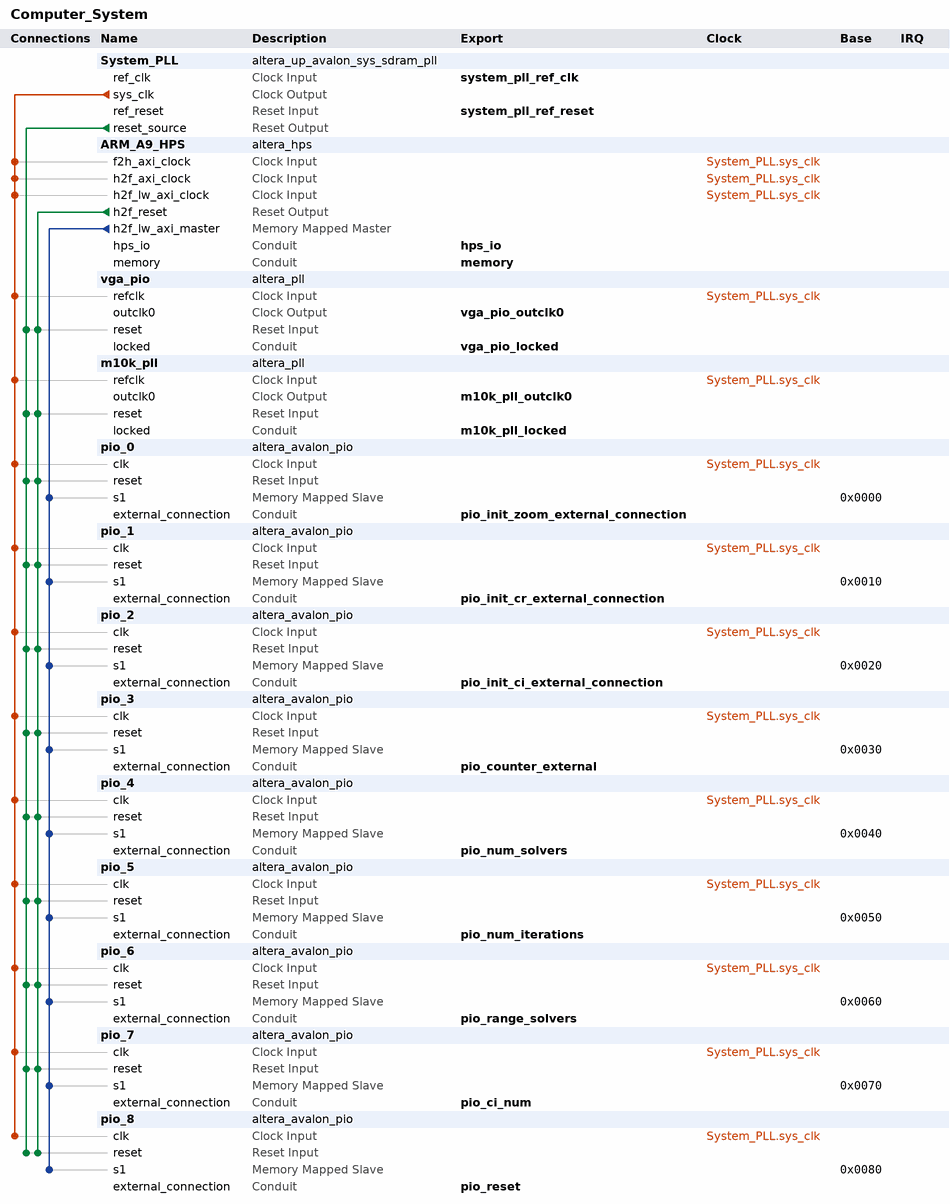
[diagram p0: system contents]
# Platform Designer (Qsys) system Computer_System, Cyclone V 5CSEMA5F31C6
# Parameters at their usual value, and those the tool derives, are not listed.
package require -exact qsys 18.1
create_system Computer_System
set_project_property DEVICE_FAMILY {Cyclone V}
set_project_property DEVICE 5CSEMA5F31C6

add_instance System_PLL altera_up_avalon_sys_sdram_pll 18.0
set_instance_parameter_value System_PLL CV_boards DE1-SoC
set_instance_parameter_value System_PLL gui_outclk 100.0
set_instance_parameter_value System_PLL gui_refclk 50.0

add_instance ARM_A9_HPS altera_hps 18.1
set_instance_parameter_value ARM_A9_HPS EMAC1_Mode RGMII
set_instance_parameter_value ARM_A9_HPS EMAC1_PinMuxing {HPS I/O Set 0}
set_instance_parameter_value ARM_A9_HPS F2SCLK_COLDRST_Enable false
set_instance_parameter_value ARM_A9_HPS F2SCLK_DBGRST_Enable false
set_instance_parameter_value ARM_A9_HPS F2SCLK_WARMRST_Enable false
set_instance_parameter_value ARM_A9_HPS F2SINTERRUPT_Enable true
set_instance_parameter_value ARM_A9_HPS F2S_Width 2
set_instance_parameter_value ARM_A9_HPS FPGA_PERIPHERAL_OUTPUT_CLOCK_FREQ_EMAC0_GTX_CLK 125
set_instance_parameter_value ARM_A9_HPS FPGA_PERIPHERAL_OUTPUT_CLOCK_FREQ_EMAC0_MD_CLK 100.0
set_instance_parameter_value ARM_A9_HPS FPGA_PERIPHERAL_OUTPUT_CLOCK_FREQ_EMAC1_GTX_CLK 125
set_instance_parameter_value ARM_A9_HPS FPGA_PERIPHERAL_OUTPUT_CLOCK_FREQ_EMAC1_MD_CLK 100.0
set_instance_parameter_value ARM_A9_HPS HPS_PROTOCOL DDR3
set_instance_parameter_value ARM_A9_HPS I2C0_Mode I2C
set_instance_parameter_value ARM_A9_HPS I2C0_PinMuxing {HPS I/O Set 0}
set_instance_parameter_value ARM_A9_HPS I2C1_Mode I2C
set_instance_parameter_value ARM_A9_HPS I2C1_PinMuxing {HPS I/O Set 0}
set_instance_parameter_value ARM_A9_HPS LWH2F_Enable true
set_instance_parameter_value ARM_A9_HPS MEM_BANKADDR_WIDTH 3
set_instance_parameter_value ARM_A9_HPS MEM_CLK_FREQ 400.0
set_instance_parameter_value ARM_A9_HPS MEM_COL_ADDR_WIDTH 10
set_instance_parameter_value ARM_A9_HPS MEM_DQ_WIDTH 32
set_instance_parameter_value ARM_A9_HPS MEM_DRV_STR RZQ/7
set_instance_parameter_value ARM_A9_HPS MEM_ROW_ADDR_WIDTH 15
set_instance_parameter_value ARM_A9_HPS MEM_RTT_NOM RZQ/4
set_instance_parameter_value ARM_A9_HPS MEM_RTT_WR RZQ/4
set_instance_parameter_value ARM_A9_HPS MEM_TCL 11
set_instance_parameter_value ARM_A9_HPS MEM_TFAW_NS 30.0
set_instance_parameter_value ARM_A9_HPS MEM_TRAS_NS 35.0
set_instance_parameter_value ARM_A9_HPS MEM_TRCD_NS 13.75
set_instance_parameter_value ARM_A9_HPS MEM_TRFC_NS 260.0
set_instance_parameter_value ARM_A9_HPS MEM_TRP_NS 13.75
set_instance_parameter_value ARM_A9_HPS MEM_VENDOR JEDEC
set_instance_parameter_value ARM_A9_HPS MEM_WTCL 8
set_instance_parameter_value ARM_A9_HPS QSPI_Mode {1 SS}
set_instance_parameter_value ARM_A9_HPS QSPI_PinMuxing {HPS I/O Set 0}
set_instance_parameter_value ARM_A9_HPS REF_CLK_FREQ 25.0
set_instance_parameter_value ARM_A9_HPS S2FCLK_USER2CLK 5
set_instance_parameter_value ARM_A9_HPS S2F_Width 3
set_instance_parameter_value ARM_A9_HPS SDIO_Mode {4-bit Data}
set_instance_parameter_value ARM_A9_HPS SDIO_PinMuxing {HPS I/O Set 0}
set_instance_parameter_value ARM_A9_HPS SPIM1_Mode {Single Slave Select}
set_instance_parameter_value ARM_A9_HPS SPIM1_PinMuxing {HPS I/O Set 0}
set_instance_parameter_value ARM_A9_HPS STM_Enable false
set_instance_parameter_value ARM_A9_HPS TIMING_BOARD_AC_SKEW 0.03
set_instance_parameter_value ARM_A9_HPS TIMING_BOARD_AC_TO_CK_SKEW 0.0
set_instance_parameter_value ARM_A9_HPS TIMING_BOARD_DQ_TO_DQS_SKEW 0.0
set_instance_parameter_value ARM_A9_HPS TIMING_BOARD_MAX_CK_DELAY 0.03
set_instance_parameter_value ARM_A9_HPS TIMING_BOARD_MAX_DQS_DELAY 0.02
set_instance_parameter_value ARM_A9_HPS TIMING_BOARD_SKEW_BETWEEN_DQS 0.08
set_instance_parameter_value ARM_A9_HPS TIMING_BOARD_SKEW_CKDQS_DIMM_MAX 0.16
set_instance_parameter_value ARM_A9_HPS TIMING_BOARD_SKEW_CKDQS_DIMM_MIN 0.09
set_instance_parameter_value ARM_A9_HPS TIMING_BOARD_SKEW_WITHIN_DQS 0.01
set_instance_parameter_value ARM_A9_HPS TIMING_TDH 65
set_instance_parameter_value ARM_A9_HPS TIMING_TDQSCK 255
set_instance_parameter_value ARM_A9_HPS TIMING_TDQSQ 125
set_instance_parameter_value ARM_A9_HPS TIMING_TDS 30
set_instance_parameter_value ARM_A9_HPS TIMING_TIH 140
set_instance_parameter_value ARM_A9_HPS TIMING_TIS 180
set_instance_parameter_value ARM_A9_HPS TIMING_TQSH 0.4
set_instance_parameter_value ARM_A9_HPS UART0_Mode {No Flow Control}
set_instance_parameter_value ARM_A9_HPS UART0_PinMuxing {HPS I/O Set 0}
set_instance_parameter_value ARM_A9_HPS USB1_Mode SDR
set_instance_parameter_value ARM_A9_HPS USB1_PinMuxing {HPS I/O Set 0}
set_instance_parameter_value ARM_A9_HPS desired_cfg_clk_mhz 100.0
set_instance_parameter_value ARM_A9_HPS desired_qspi_clk_mhz 400.0

add_instance vga_pio altera_pll 18.1
set_instance_parameter_value vga_pio gui_device_speed_grade 2
set_instance_parameter_value vga_pio gui_number_of_clocks 1
set_instance_parameter_value vga_pio gui_operation_mode direct
set_instance_parameter_value vga_pio gui_output_clock_frequency0 25.0
set_instance_parameter_value vga_pio gui_pll_mode {Integer-N PLL}
set_instance_parameter_value vga_pio gui_reference_clock_frequency 100.0
set_instance_parameter_value vga_pio gui_use_locked true

add_instance m10k_pll altera_pll 18.1
set_instance_parameter_value m10k_pll gui_device_speed_grade 2
set_instance_parameter_value m10k_pll gui_number_of_clocks 1
set_instance_parameter_value m10k_pll gui_operation_mode direct
set_instance_parameter_value m10k_pll gui_output_clock_frequency0 100.0
set_instance_parameter_value m10k_pll gui_pll_mode {Integer-N PLL}
set_instance_parameter_value m10k_pll gui_reference_clock_frequency 100.0
set_instance_parameter_value m10k_pll gui_use_locked true

add_instance pio_0 altera_avalon_pio 18.1
set_instance_parameter_value pio_0 direction Output
set_instance_parameter_value pio_0 width 32

add_instance pio_1 altera_avalon_pio 18.1
set_instance_parameter_value pio_1 direction Output
set_instance_parameter_value pio_1 width 32

add_instance pio_2 altera_avalon_pio 18.1
set_instance_parameter_value pio_2 direction Output
set_instance_parameter_value pio_2 width 32

add_instance pio_3 altera_avalon_pio 18.1
set_instance_parameter_value pio_3 direction Input
set_instance_parameter_value pio_3 width 32

add_instance pio_4 altera_avalon_pio 18.1
set_instance_parameter_value pio_4 direction Output
set_instance_parameter_value pio_4 width 32

add_instance pio_5 altera_avalon_pio 18.1
set_instance_parameter_value pio_5 direction Output
set_instance_parameter_value pio_5 width 32

add_instance pio_6 altera_avalon_pio 18.1
set_instance_parameter_value pio_6 direction Output
set_instance_parameter_value pio_6 width 32

add_instance pio_7 altera_avalon_pio 18.1
set_instance_parameter_value pio_7 direction Output
set_instance_parameter_value pio_7 width 32

add_instance pio_8 altera_avalon_pio 18.1
set_instance_parameter_value pio_8 direction Output
set_instance_parameter_value pio_8 width 32

# connections
add_connection System_PLL.sys_clk ARM_A9_HPS.f2h_axi_clock clock
add_connection System_PLL.sys_clk ARM_A9_HPS.h2f_axi_clock clock
add_connection System_PLL.sys_clk ARM_A9_HPS.h2f_lw_axi_clock clock
add_connection System_PLL.sys_clk m10k_pll.refclk clock
add_connection System_PLL.sys_clk pio_0.clk clock
add_connection System_PLL.sys_clk pio_1.clk clock
add_connection System_PLL.sys_clk pio_2.clk clock
add_connection System_PLL.sys_clk pio_3.clk clock
add_connection System_PLL.sys_clk pio_4.clk clock
add_connection System_PLL.sys_clk pio_5.clk clock
add_connection System_PLL.sys_clk pio_6.clk clock
add_connection System_PLL.sys_clk pio_7.clk clock
add_connection System_PLL.sys_clk pio_8.clk clock
add_connection System_PLL.sys_clk vga_pio.refclk clock
add_connection ARM_A9_HPS.h2f_reset m10k_pll.reset reset
add_connection ARM_A9_HPS.h2f_reset pio_0.reset reset
add_connection ARM_A9_HPS.h2f_reset pio_1.reset reset
add_connection ARM_A9_HPS.h2f_reset pio_2.reset reset
add_connection ARM_A9_HPS.h2f_reset pio_3.reset reset
add_connection ARM_A9_HPS.h2f_reset pio_4.reset reset
add_connection ARM_A9_HPS.h2f_reset pio_5.reset reset
add_connection ARM_A9_HPS.h2f_reset pio_6.reset reset
add_connection ARM_A9_HPS.h2f_reset pio_7.reset reset
add_connection ARM_A9_HPS.h2f_reset pio_8.reset reset
add_connection ARM_A9_HPS.h2f_reset vga_pio.reset reset
add_connection System_PLL.reset_source m10k_pll.reset reset
add_connection System_PLL.reset_source pio_0.reset reset
add_connection System_PLL.reset_source pio_1.reset reset
add_connection System_PLL.reset_source pio_2.reset reset
add_connection System_PLL.reset_source pio_3.reset reset
add_connection System_PLL.reset_source pio_4.reset reset
add_connection System_PLL.reset_source pio_5.reset reset
add_connection System_PLL.reset_source pio_6.reset reset
add_connection System_PLL.reset_source pio_7.reset reset
add_connection System_PLL.reset_source pio_8.reset reset
add_connection System_PLL.reset_source vga_pio.reset reset
add_connection ARM_A9_HPS.h2f_lw_axi_master pio_0.s1 avalon
set_connection_parameter_value ARM_A9_HPS.h2f_lw_axi_master/pio_0.s1 baseAddress 0x0000
add_connection ARM_A9_HPS.h2f_lw_axi_master pio_1.s1 avalon
set_connection_parameter_value ARM_A9_HPS.h2f_lw_axi_master/pio_1.s1 baseAddress 0x0010
add_connection ARM_A9_HPS.h2f_lw_axi_master pio_2.s1 avalon
set_connection_parameter_value ARM_A9_HPS.h2f_lw_axi_master/pio_2.s1 baseAddress 0x0020
add_connection ARM_A9_HPS.h2f_lw_axi_master pio_3.s1 avalon
set_connection_parameter_value ARM_A9_HPS.h2f_lw_axi_master/pio_3.s1 baseAddress 0x0030
add_connection ARM_A9_HPS.h2f_lw_axi_master pio_4.s1 avalon
set_connection_parameter_value ARM_A9_HPS.h2f_lw_axi_master/pio_4.s1 baseAddress 0x0040
add_connection ARM_A9_HPS.h2f_lw_axi_master pio_5.s1 avalon
set_connection_parameter_value ARM_A9_HPS.h2f_lw_axi_master/pio_5.s1 baseAddress 0x0050
add_connection ARM_A9_HPS.h2f_lw_axi_master pio_6.s1 avalon
set_connection_parameter_value ARM_A9_HPS.h2f_lw_axi_master/pio_6.s1 baseAddress 0x0060
add_connection ARM_A9_HPS.h2f_lw_axi_master pio_7.s1 avalon
set_connection_parameter_value ARM_A9_HPS.h2f_lw_axi_master/pio_7.s1 baseAddress 0x0070
add_connection ARM_A9_HPS.h2f_lw_axi_master pio_8.s1 avalon
set_connection_parameter_value ARM_A9_HPS.h2f_lw_axi_master/pio_8.s1 baseAddress 0x0080

# exported interfaces
add_interface hps_io conduit end
set_interface_property hps_io EXPORT_OF ARM_A9_HPS.hps_io
add_interface m10k_pll_locked conduit end
set_interface_property m10k_pll_locked EXPORT_OF m10k_pll.locked
add_interface m10k_pll_outclk0 clock source
set_interface_property m10k_pll_outclk0 EXPORT_OF m10k_pll.outclk0
add_interface memory conduit end
set_interface_property memory EXPORT_OF ARM_A9_HPS.memory
add_interface pio_ci_num conduit end
set_interface_property pio_ci_num EXPORT_OF pio_7.external_connection
add_interface pio_counter_external conduit end
set_interface_property pio_counter_external EXPORT_OF pio_3.external_connection
add_interface pio_init_ci_external_connection conduit end
set_interface_property pio_init_ci_external_connection EXPORT_OF pio_2.external_connection
add_interface pio_init_cr_external_connection conduit end
set_interface_property pio_init_cr_external_connection EXPORT_OF pio_1.external_connection
add_interface pio_init_zoom_external_connection conduit end
set_interface_property pio_init_zoom_external_connection EXPORT_OF pio_0.external_connection
add_interface pio_num_iterations conduit end
set_interface_property pio_num_iterations EXPORT_OF pio_5.external_connection
add_interface pio_num_solvers conduit end
set_interface_property pio_num_solvers EXPORT_OF pio_4.external_connection
add_interface pio_range_solvers conduit end
set_interface_property pio_range_solvers EXPORT_OF pio_6.external_connection
add_interface pio_reset conduit end
set_interface_property pio_reset EXPORT_OF pio_8.external_connection
add_interface system_pll_ref_clk clock sink
set_interface_property system_pll_ref_clk EXPORT_OF System_PLL.ref_clk
add_interface system_pll_ref_reset reset sink
set_interface_property system_pll_ref_reset EXPORT_OF System_PLL.ref_reset
add_interface vga_pio_locked conduit end
set_interface_property vga_pio_locked EXPORT_OF vga_pio.locked
add_interface vga_pio_outclk0 clock source
set_interface_property vga_pio_outclk0 EXPORT_OF vga_pio.outclk0

set_interconnect_requirement {$system} qsys_mm.clockCrossingAdapter HANDSHAKE
set_interconnect_requirement {$system} qsys_mm.enableEccProtection FALSE
set_interconnect_requirement {$system} qsys_mm.insertDefaultSlave FALSE
set_interconnect_requirement {$system} qsys_mm.maxAdditionalLatency 1

save_system Computer_System.qsys
